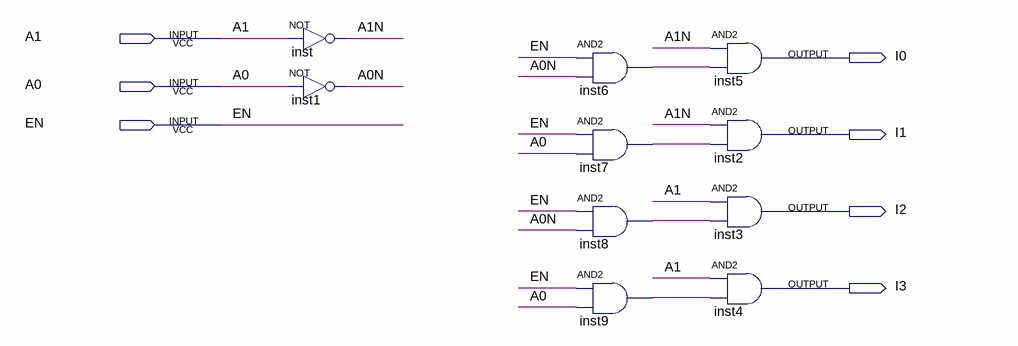
[diagram p0: schematic sheet]
// Quartus schematic Decoder2to4_EN.bdf as structural Verilog: 10 symbols, 7 pins
module Decoder2to4_EN (
  input  A1,
  input  A0,
  input  EN,
  output I0,
  output I1,
  output I2,
  output I3
);

  wire A0N, A1N, inst6_out, inst7_out, inst8_out, inst9_out;

  not inst (A1N, A1);
  not inst1 (A0N, A0);
  and inst6 (inst6_out, EN, A0N);
  and inst7 (inst7_out, EN, A0);
  and inst8 (inst8_out, EN, A0N);
  and inst9 (inst9_out, EN, A0);
  and inst5 (I0, A1N, inst6_out);
  and inst2 (I1, A1N, inst7_out);
  and inst3 (I2, A1, inst8_out);
  and inst4 (I3, A1, inst9_out);
endmodule
